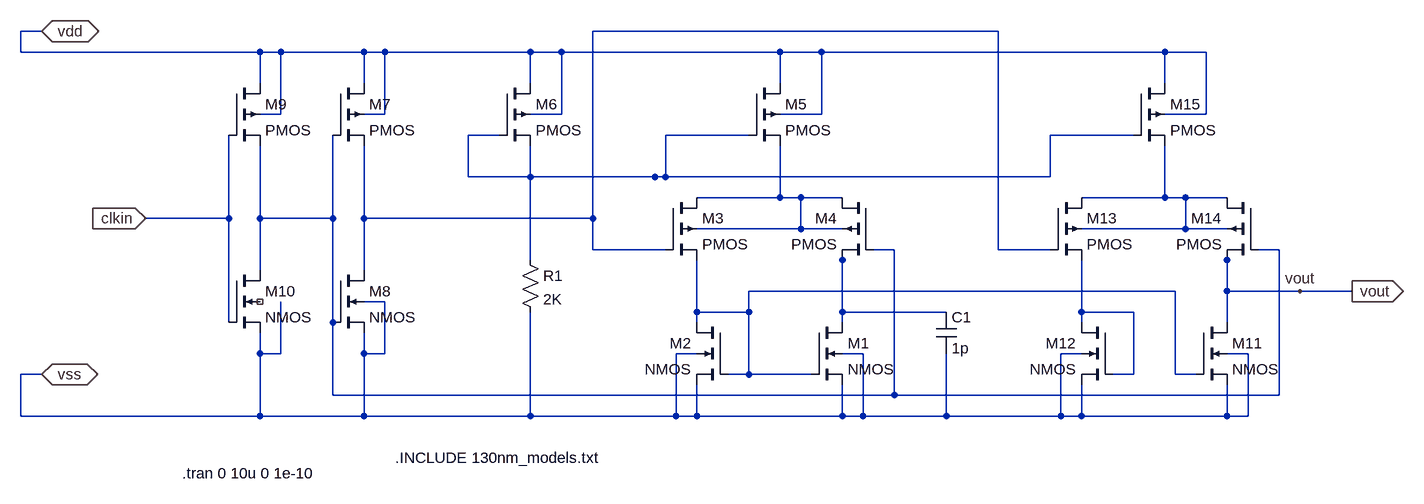
[diagram p0: schematic CurrentSteeringRampGnerator3.asc]
CurrentSteeringRampGnerator3.asc, the LTspice schematic file:
Version 4
SHEET 1 1184 680
WIRE -944 -224 -976 -224
WIRE 528 -224 -96 -224
WIRE -976 -192 -976 -224
WIRE -608 -192 -976 -192
WIRE -576 -192 -608 -192
WIRE -448 -192 -576 -192
WIRE -416 -192 -448 -192
WIRE -192 -192 -416 -192
WIRE -144 -192 -192 -192
WIRE 192 -192 -144 -192
WIRE 256 -192 192 -192
WIRE 784 -192 256 -192
WIRE 848 -192 784 -192
WIRE -608 -144 -608 -192
WIRE -448 -144 -448 -192
WIRE -192 -144 -192 -192
WIRE 192 -144 192 -192
WIRE 784 -144 784 -192
WIRE -576 -96 -576 -192
WIRE -576 -96 -608 -96
WIRE -416 -96 -416 -192
WIRE -416 -96 -448 -96
WIRE -144 -96 -144 -192
WIRE -144 -96 -192 -96
WIRE 256 -96 256 -192
WIRE 256 -96 192 -96
WIRE 848 -96 848 -192
WIRE 848 -96 784 -96
WIRE -240 -64 -288 -64
WIRE 144 -64 16 -64
WIRE 736 -64 608 -64
WIRE -288 0 -288 -64
WIRE -192 0 -192 -48
WIRE -192 0 -288 0
WIRE 16 0 16 -64
WIRE 16 0 -192 0
WIRE 608 0 608 -64
WIRE 608 0 16 0
WIRE 192 32 192 -48
WIRE 192 32 64 32
WIRE 224 32 192 32
WIRE 288 32 224 32
WIRE 784 32 784 -48
WIRE 784 32 656 32
WIRE 816 32 784 32
WIRE 880 32 816 32
WIRE -656 64 -656 -64
WIRE -656 64 -784 64
WIRE -608 64 -608 -48
WIRE -496 64 -496 -64
WIRE -496 64 -608 64
WIRE -448 64 -448 -48
WIRE -96 64 -96 -224
WIRE -96 64 -448 64
WIRE 224 80 224 32
WIRE 224 80 64 80
WIRE 288 80 224 80
WIRE 816 80 816 32
WIRE 816 80 656 80
WIRE 880 80 816 80
WIRE -96 112 -96 64
WIRE 16 112 -96 112
WIRE 368 112 336 112
WIRE 528 112 528 -224
WIRE 608 112 528 112
WIRE 960 112 928 112
WIRE -192 128 -192 0
WIRE 288 128 288 112
WIRE 880 128 880 112
WIRE -608 144 -608 64
WIRE -448 144 -448 64
WIRE 800 176 144 176
WIRE 880 176 880 128
WIRE 992 176 880 176
WIRE 1072 176 992 176
WIRE -416 192 -448 192
WIRE 64 208 64 128
WIRE 144 208 144 176
WIRE 144 208 64 208
WIRE 288 208 288 128
WIRE 448 208 288 208
WIRE 656 208 656 128
WIRE 736 208 656 208
WIRE -656 224 -656 64
WIRE -496 224 -496 64
WIRE 64 224 64 208
WIRE 288 224 288 208
WIRE 656 224 656 208
WIRE 880 224 880 176
WIRE -608 272 -608 240
WIRE -576 272 -576 192
WIRE -576 272 -608 272
WIRE -448 272 -448 240
WIRE -416 272 -416 192
WIRE -416 272 -448 272
WIRE 64 272 32 272
WIRE 320 272 288 272
WIRE 656 272 624 272
WIRE 912 272 880 272
WIRE -944 304 -976 304
WIRE 144 304 144 208
WIRE 144 304 112 304
WIRE 240 304 144 304
WIRE 736 304 736 208
WIRE 736 304 704 304
WIRE 800 304 800 176
WIRE 832 304 800 304
WIRE -496 336 -496 224
WIRE 368 336 368 112
WIRE 368 336 -496 336
WIRE 960 336 960 112
WIRE 960 336 368 336
WIRE -976 368 -976 304
WIRE -608 368 -608 272
WIRE -608 368 -976 368
WIRE -448 368 -448 272
WIRE -448 368 -608 368
WIRE -192 368 -192 208
WIRE -192 368 -448 368
WIRE 32 368 32 272
WIRE 32 368 -192 368
WIRE 64 368 64 320
WIRE 64 368 32 368
WIRE 288 368 288 320
WIRE 288 368 64 368
WIRE 320 368 320 272
WIRE 320 368 288 368
WIRE 448 368 448 272
WIRE 448 368 320 368
WIRE 624 368 624 272
WIRE 624 368 448 368
WIRE 656 368 656 320
WIRE 656 368 624 368
WIRE 880 368 880 320
WIRE 880 368 656 368
WIRE 912 368 912 272
WIRE 912 368 880 368
WIRE 0 0 0 0
FLAG -944 -224 vdd
IOPIN -944 -224 BiDir
FLAG -944 304 vss
IOPIN -944 304 BiDir
FLAG -784 64 clkin
IOPIN -784 64 In
FLAG 992 176 vout
FLAG 1072 176 vout
IOPIN 1072 176 Out
SYMBOL nmos4 240 224 R0
SYMATTR InstName M1
SYMATTR Value2 l=1u w=20u
SYMBOL nmos4 112 224 M0
SYMATTR InstName M2
SYMATTR Value2 l=1u w=20u
SYMBOL pmos4 16 32 R0
SYMATTR InstName M3
SYMATTR Value2 l=1u w=20u
SYMBOL pmos4 336 32 M0
SYMATTR InstName M4
SYMATTR Value2 l=1u w=20u
SYMBOL pmos4 144 -144 R0
SYMATTR InstName M5
SYMATTR Value2 l=1u w=20u
SYMBOL pmos4 -240 -144 R0
SYMATTR InstName M6
SYMATTR Value2 l=1u w=10u
SYMBOL res -208 112 R0
SYMATTR InstName R1
SYMATTR Value 2K
SYMBOL pmos4 -496 -144 R0
SYMATTR InstName M7
SYMBOL nmos4 -496 144 R0
SYMATTR InstName M8
SYMBOL pmos4 -656 -144 R0
SYMATTR InstName M9
SYMATTR Value2 l=.2u w=2u
SYMBOL nmos4 -656 144 R0
SYMATTR InstName M10
SYMATTR Value2 l=.2u w=1u
SYMBOL cap 432 208 R0
SYMATTR InstName C1
SYMATTR Value 1p
SYMBOL nmos4 832 224 R0
SYMATTR InstName M11
SYMATTR Value2 l=1u w=20u
SYMBOL nmos4 704 224 M0
SYMATTR InstName M12
SYMATTR Value2 l=1u w=20u
SYMBOL pmos4 608 32 R0
SYMATTR InstName M13
SYMATTR Value2 l=1u w=20u
SYMBOL pmos4 928 32 M0
SYMATTR InstName M14
SYMATTR Value2 l=1u w=20u
SYMBOL pmos4 736 -144 R0
SYMATTR InstName M15
SYMATTR Value2 l=1u w=20u
TEXT -728 456 Left 2 !.tran 0 10u 0 1e-10
TEXT -400 432 Left 2 !.INCLUDE 130nm_models.txt

The netlist it stands for:
* CurrentSteeringRampGnerator3.asc
M1 N006 N007 vss vss NMOS l=1u w=20u
M2 N007 N007 vss vss NMOS l=1u w=20u
M3 N003 N001 N007 N003 PMOS l=1u w=20u
M4 N003 N005 N006 N003 PMOS l=1u w=20u
M5 vdd N002 N003 vdd PMOS l=1u w=20u
M6 vdd N002 N002 vdd PMOS l=1u w=10u
R1 N002 vss 2K
M7 vdd N005 N001 vdd PMOS
M8 N001 N005 vss vss NMOS
M9 vdd clkin N005 vdd PMOS l=.2u w=2u
M10 N005 clkin vss NC_01 NMOS l=.2u w=1u
C1 N006 vss 1p
M11 vout N007 vss vss NMOS l=1u w=20u
M12 N008 N008 vss vss NMOS l=1u w=20u
M13 N004 N001 N008 N004 PMOS l=1u w=20u
M14 N004 N005 vout N004 PMOS l=1u w=20u
M15 vdd N002 N004 vdd PMOS l=1u w=20u
.model NMOS NMOS
.model PMOS PMOS
.lib standard.mos
.tran 0 10u 0 1e-10
.INCLUDE 130nm_models.txt
.backanno
.end